# Altium project PocketLab_DMM_EVT0.PrjPcb (part 2 of 2)

## Sheet 40_INPUT_ROUTING.SchDoc
size A; SheetNumber: 5; SheetTotal: 8
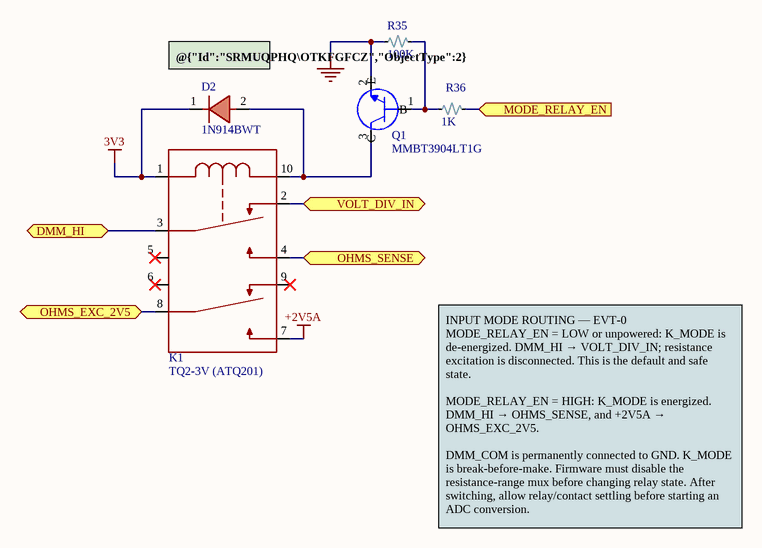
[diagram p2: 40_INPUT_ROUTING.SchDoc]

### Parts
D2  1N914BWT  [1N914BWT]
K1  TQ2-3V (ATQ201)  [TQ2-3V]
Q1  MMBT3904LT1G  [MMBT3904]
R35  100K  [R0805]
R36  1K  [R0805]

### Ports
DMM_HI (bidir, see 00_SYSTEM_TOP[4C], 70_MODULE_INTERFACE[1B]), MODE_RELAY_EN (in, see 00_SYSTEM_TOP[3B], 20_MCU_BLE[1C]), OHMS_EXC_2V5 (bidir, see 00_SYSTEM_TOP[4B], 60_RESISTANCE_FRONTEND[4B]), OHMS_SENSE (bidir, see 00_SYSTEM_TOP[3B], 60_RESISTANCE_FRONTEND[2B]), VOLT_DIV_IN (bidir, see 00_SYSTEM_TOP[3C], 50_VOLTAGE_FRONTEND[2B])

### Nets
3V3: D2.1(cathode) K1.1
+2V5A: K1.7
GND: Q1.2(E) R35.1
NetD2_2: D2.2(anode) K1.10 Q1.3(C)
NetJ4_1: K1.3 ; port DMM_HI
NetK1_2: K1.2 ; port VOLT_DIV_IN
NetK1_4: K1.4 ; port OHMS_SENSE
NetK1_8: K1.8 ; port OHMS_EXC_2V5
NetQ1_1: Q1.1(B) R35.2 R36.1
NetR36_2: R36.2 ; port MODE_RELAY_EN

Not connected (* = marked no-connect by the designer): K1 5* 6* 9*

### Notes on the sheet
- (near D2) @{"Id":"SRMUQPHQ\OTKFGFCZ","ObjectType":2} V/Ω Select
- INPUT MODE ROUTING — EVT-0
  MODE_RELAY_EN = LOW or unpowered: K_MODE is de-energized. DMM_HI → VOLT_DIV_IN; resistance excitation is disconnected. This is the default and safe state.
  MODE_RELAY_EN = HIGH: K_MODE is energized. DMM_HI → OHMS_SENSE, and +2V5A → OHMS_EXC_2V5.
  DMM_COM is permanently connected to GND. K_MODE is break-before-make. Firmware must disable the resistance-range mux before changing relay state. After switching, allow relay/contact settling before starting an ADC conversion.

### Library data of the parts
D2 = 1N914BWT: DIODE STANDARD 75V 200MA SOD523F; Manufacturer: onsemi; Manufacturer Lifecycle Status: ACTIVE; Value: 4pF; Element Configuration: Single; Forward Current: 300mA; Forward Voltage: 720mV; Max Junction Temperature (Tj): 150°C; Max Output current: 150mA; Max Power Dissipation: 200mW; Max Reverse Leakage Current: 5µA; Number of Elements: 1; Recovery Time: 4ns; Reverse Voltage: 100V; Supplier: DigiKey; Supplier Part Number: 1N914BWTCT-ND; Manufacturer Part Number: 1N914BWT; RoHS: Compliant; Category: Rectifier Diodes; Stock: 1541183; Pricing: 1=0.17, 10=0.102, 50=0.0726, 100=0.0629, 500=0.04556 (USD); Average Rectified Current: 200mA; China RoHS: Compliant; Contact Plating: Tin; Country of Origin: Mainland China; Export Control Classification Number (ECCN) Code: EAR99; Height: 700µm; Harmonized Tariff Schedule (HTS) Code: 8541.10.00.70; Introduction Date: 2008-03-18; Lead Free: Lead Free; Lifecycle Status: Production; Max Operating Temperature: 150°C; Max Repetitive Reverse Voltage (Vrrm): 75V; Max Reverse Voltage (DC): 75V; Min Operating Temperature: -55°C; Mounting Technology: Surface Mount; Pins: 2; Number of Terminals: 2; Peak Reverse Current: 5µA; Power Dissipation: 200mW; Radiation Hardening: No; REACH SVHC: Yes; Reverse Recovery Time: 4ns; Reverse Standoff Voltage: 75V; Schedule B: 8541100070, 8541100070|8541100070|8541100070|8541100070|8541100070; Weight: 10mg; ComponentLink1URL: https://datasheet.octopart.com:443/1N914BWT-ON-Semiconductor-datasheet-137236191.pdf?src-supplier=JRH+Electronics; ComponentLink1Description: https://datasheet.octopart.com:443/1N914BWT-ON-Semiconductor-datasheet-137236191.pdf?src-supplier=JRH+Electronics; ComponentLink2URL: https://sigma.octopart.com:443/138897313/technical_drawing/ON-Semiconductor-1N914BWT.pdf?src-supplier=Upverter; ComponentLink2Description: https://sigma.octopart.com:443/138897313/technical_drawing/ON-Semiconductor-1N914BWT.pdf?src-supplier=Upverter; ComponentLink3URL: https://datasheet.octopart.com:443/1N914BWT-ON-Semiconductor-datasheet-8641207.pdf?src-supplier=IHS; ComponentLink3Description: https://datasheet.octopart.com:443/1N914BWT-ON-Semiconductor-datasheet-8641207.pdf?src-supplier=IHS; ComponentLink4URL: https://datasheet.octopart.com:443/1N914BWT-onsemi-datasheet-181265884.pdf?src-supplier=IHS; ComponentLink4Description: https://datasheet.octopart.com:443/1N914BWT-onsemi-datasheet-181265884.pdf?src-supplier=IHS; ComponentLink5URL: https://datasheet.octopart.com:443/1N914BWT-ON-Semiconductor-datasheet-85393215.pdf?src-supplier=onsemi; ComponentLink5Description: https://datasheet.octopart.com:443/1N914BWT-ON-Semiconductor-datasheet-85393215.pdf?src-supplier=onsemi; ComponentLink6URL: https://datasheet.octopart.com:443/1N914BWT-ON-Semiconductor-datasheet-86684494.pdf?src-supplier=onsemi; ComponentLink6Description: https://datasheet.octopart.com:443/1N914BWT-ON-Semiconductor-datasheet-86684494.pdf?src-supplier=onsemi; ComponentLink7URL: https://datasheet.octopart.com:443/1N914BWT-ON-Semiconductor-datasheet-86681974.pdf?src-supplier=element14+APAC; ComponentLink7Description: https://datasheet.octopart.com:443/1N914BWT-ON-Semiconductor-datasheet-86681974.pdf?src-supplier=element14+APAC; ComponentLink8URL: https://datasheet.octopart.com:443/1N914BWT-Fairchild-datasheet-597795.pdf?src-supplier=Future+Electronics; ComponentLink8Description: https://datasheet.octopart.com:443/1N914BWT-Fairchild-datasheet-597795.pdf?src-supplier=Future+Electronics; ComponentLink9URL: https://sigma.octopart.com:443/17343427/technical_drawing/Fairchild-Semiconductor-1N914BWT.pdf?src-supplier=Fairchild+Semiconductor; ComponentLink9Description: https://sigma.octopart.com:443/17343427/technical_drawing/Fairchild-Semiconductor-1N914BWT.pdf?src-supplier=Fairchild+Semiconductor; ComponentLink10URL: https://datasheet.octopart.com:443/1N914BWT-Fairchild-Semiconductor-datasheet-67878665.pdf?src-supplier=Farnell; ComponentLink10Description: https://datasheet.octopart.com:443/1N914BWT-Fairchild-Semiconductor-datasheet-67878665.pdf?src-supplier=Farnell; ComponentLink11URL: https://datasheet.octopart.com:443/1N914BWT-Fairchild-Semiconductor-datasheet-68649996.pdf?src-supplier=Farnell; ComponentLink11Description: https://datasheet.octopart.com:443/1N914BWT-Fairchild-Semiconductor-datasheet-68649996.pdf?src-supplier=Farnell; ComponentLink12URL: https://datasheet.octopart.com:443/1N914BWT-Fairchild-Semiconductor-datasheet-78857206.pdf?src-supplier=Farnell; ComponentLink12Description: https://datasheet.octopart.com:443/1N914BWT-Fairchild-Semiconductor-datasheet-78857206.pdf?src-supplier=Farnell; ComponentLink13URL: https://datasheet.octopart.com:443/1N914BWT-Fairchild-Semiconductor-datasheet-67909706.pdf?src-supplier=Newark; ComponentLink13Description: https://datasheet.octopart.com:443/1N914BWT-Fairchild-Semiconductor-datasheet-67909706.pdf?src-supplier=Newark; ComponentLink14URL: https://datasheet.octopart.com:443/1N914BWT-Fairchild-Semiconductor-datasheet-68364971.pdf?src-supplier=Newark; ComponentLink14Description: https://datasheet.octopart.com:443/1N914BWT-Fairchild-Semiconductor-datasheet-68364971.pdf?src-supplier=Newark; ComponentLink15URL: https://datasheet.octopart.com:443/1N914BWT-Fairchild-Semiconductor-datasheet-71421042.pdf?src-supplier=Newark; ComponentLink15Description: https://datasheet.octopart.com:443/1N914BWT-Fairchild-Semiconductor-datasheet-71421042.pdf?src-supplier=Newark; ComponentLink16URL: http://sigma.octopart.com:80/150599636/rohs_statement/ON-Semiconductor-1N914BWT.pdf?src-supplier=Compliance+Statements; ComponentLink16Description: http://sigma.octopart.com:80/150599636/rohs_statement/ON-Semiconductor-1N914BWT.pdf?src-supplier=Compliance+Statements; ComponentLink17URL: http://sigma.octopart.com:80/17343722/reach_statement/Fairchild-Semiconductor-1N914BWT.pdf?src-supplier=Compliance+Statements; ComponentLink17Description: http://sigma.octopart.com:80/17343722/reach_statement/Fairchild-Semiconductor-1N914BWT.pdf?src-supplier=Compliance+Statements; ComponentLink18URL: http://sigma.octopart.com:80/17343723/materials_sheet/Fairchild-Semiconductor-1N914BWT.pdf?src-supplier=Compliance+Statements; ComponentLink18Description: http://sigma.octopart.com:80/17343723/materials_sheet/Fairchild-Semiconductor-1N914BWT.pdf?src-supplier=Compliance+Statements; ComponentLink19URL: http://sigma.octopart.com:80/33033631/reach_statement/Fairchild-Semiconductor-1N914BWT.pdf?src-supplier=Compliance+Statements; ComponentLink19Description: http://sigma.octopart.com:80/33033631/reach_statement/Fairchild-Semiconductor-1N914BWT.pdf?src-supplier=Compliance+Statements; ComponentLink20URL: http://sigma.octopart.com:80/33033633/materials_sheet/Fairchild-Semiconductor-1N914BWT.pdf?src-supplier=Compliance+Statements; ComponentLink20Description: http://sigma.octopart.com:80/33033633/materials_sheet/Fairchild-Semiconductor-1N914BWT.pdf?src-supplier=Compliance+Statements; ComponentLink21URL: http://sigma.octopart.com:80/reach_statement/ON-Semiconductor-company-79.pdf?src-supplier=Compliance+Statements; ComponentLink21Description: http://sigma.octopart.com:80/reach_statement/ON-Semiconductor-company-79.pdf?src-supplier=Compliance+Statements; ComponentLink22URL: http://sigma.octopart.com:80/rohs_statement/Fairchild-Semiconductor-company-11.pdf?src-supplier=Compliance+Statements; ComponentLink22Description: http://sigma.octopart.com:80/rohs_statement/Fairchild-Semiconductor-company-11.pdf?src-supplier=Compliance+Statements; ComponentLink23URL: http://sigma.octopart.com:80/rohs_statement/Fairchild-Semiconductor-company-10.pdf?src-supplier=Compliance+Statements; ComponentLink23Description: http://sigma.octopart.com:80/rohs_statement/Fairchild-Semiconductor-company-10.pdf?src-supplier=Compliance+Statements; ComponentLink24URL: http://sigma.octopart.com:80/reach_statement/Fairchild-Semiconductor-company-9.pdf?src-supplier=Compliance+Statements; ComponentLink24Description: http://sigma.octopart.com:80/reach_statement/Fairchild-Semiconductor-company-9.pdf?src-supplier=Compliance+Statements; ComponentLink25URL: https://octopart.com:443/opatz8j6/c1?t=AH9zcMxkeAdW6q2Eq6b7IE3o8p7oJyfCCWP2LD7p9dkg8_1XgT_uIYUIfv7lhcHO3Lm2dWJ0vyWcCXTmI-m6i_e3bz1ygKnSbTknupXSFzBNj_HpxZskJCgN2zBylGov1HFklhlqrpHlO6K5AZ62MDKnKfmeey-sKx5zLLXPz3vdpqjCapaf97_w5ymRJ4vykqn37E9iqiVHqZfTnoawsGL7kQ2_tC5XJG82m9dj8CjUa7IyLd46aJZw47PNoUwIy-tktB34mxPYkgoIYMPq_y-2_Zl7oOQxNhckIE8NgxTfVSFSWYFJhemMnrsZ4FmlJAaE9JBv7LsFpjF61P3RKffqM8U7tIBEs0IC&src-supplier=Compliance+Statements; ComponentLink25Description: https://octopart.com:443/opatz8j6/c1?t=AH9zcMxkeAdW6q2Eq6b7IE3o8p7oJyfCCWP2LD7p9dkg8_1XgT_uIYUIfv7lhcHO3Lm2dWJ0vyWcCXTmI-m6i_e3bz1ygKnSbTknupXSFzBNj_HpxZskJCgN2zBylGov1HFklhlqrpHlO6K5AZ62MDKnKfmeey-sKx5zLLXPz3vdpqjCapaf97_w5ymRJ4vykqn37E9iqiVHqZfTnoawsGL7kQ2_tC5XJG82m9dj8CjUa7IyLd46aJZw47PNoUwIy-tktB34mxPYkgoIYMPq_y-2_Zl7oOQxNhckIE8NgxTfVSFSWYFJhemMnrsZ4FmlJAaE9JBv7LsFpjF61P3RKffqM8U7tIBEs0IC&src-supplier=Compliance+Statements; ComponentLink26URL: https://octopart.com:443/opatz8j6/c1?t=xkFbza4jrI2CRbegTQyc3OoFkt0wJLseTZvNZoS9ZK7og4IYeJkRm8Wtlicq30gKrCmXKYAvwhfUWUd8QrgiWtGr-1lPch9YM6_eRKvxcMBeJPMVF6fuXrX8qVzrjdJE_ba4nBK8Av8ejJiUOIqoCK4JwxbrI670KPmrS7lZhK3d4M9ClcgV1EdcA89oUfKfxSXdDQ7ptMPVQyO9dYqcVLlwZjgXP6pJFSDaJyXdYctBiNO3pJoYg6YNiGqR74o654sFLuxF_heBqsxkg6UEULjNDBDBmm8bGtxjuaEt4DFGZZVVzAgQnbURpSvQrJSnNWgco6nydRWV0EfJMGefeNg22mY4HSjyeBXs9g&src-supplier=Compliance+Statements; ComponentLink26Description: https://octopart.com:443/opatz8j6/c1?t=xkFbza4jrI2CRbegTQyc3OoFkt0wJLseTZvNZoS9ZK7og4IYeJkRm8Wtlicq30gKrCmXKYAvwhfUWUd8QrgiWtGr-1lPch9YM6_eRKvxcMBeJPMVF6fuXrX8qVzrjdJE_ba4nBK8Av8ejJiUOIqoCK4JwxbrI670KPmrS7lZhK3d4M9ClcgV1EdcA89oUfKfxSXdDQ7ptMPVQyO9dYqcVLlwZjgXP6pJFSDaJyXdYctBiNO3pJoYg6YNiGqR74o654sFLuxF_heBqsxkg6UEULjNDBDBmm8bGtxjuaEt4DFGZZVVzAgQnbURpSvQrJSnNWgco6nydRWV0EfJMGefeNg22mY4HSjyeBXs9g&src-supplier=Compliance+Statements
K1 = TQ2-3V: Electromechanical Relay Double Pole Double Throw 1A 3 Volt 64.3Ohm Through Hole; Manufacturer: Panasonic; Manufacturer Lifecycle Status: ACTIVE; Coil Current: 47mA; Coil Power: 140mW; Coil Resistance: 64.3Ω; Coil Type: Non-Latching; Coil Voltage (DC): 2.25V; Contact Resistance: 50Ω; Contact Voltage Rating (AC): 125V; Electrical Life: 200kcycles; Insertion Loss (dB): 0.6dB; Max Voltage Rating (DC): 110V; Number of Contacts: 2; Operate Time: 3ms; Power Dissipation: 140W; Ratings: CSA; Relay Type: Telecom; Throw Configuration: DPDT; Supplier: DigiKey; Supplier Part Number: 255-1225-5-ND; Manufacturer Part Number: TQ2-3V; RoHS: Compliant; Category: Signal Relays; Stock: 2058; Pricing: 1=2.36, 10=2.103, 25=2.0084, 50=1.9398, 100=1.8734, 250=1.78892, 500=1.72756, 1000=1.66825, 5000=1.53812 (USD); Case/Package: DIP; Contact Current Rating: 1A; Contact Material: Gold, Silver; Contact Plating: Gold, Silver; Current Rating: 1A; Depth: 9mm; Height: 5mm; Lead Free: Lead Free; Length: 14mm; Lifecycle Status: Production; Max Current Rating: 1A; Max Operating Temperature: 70°C; Max Voltage Rating (AC): 125V; Min Operating Temperature: -40°C; Mounting Technology: Through Hole; Pins: 8; Packaging: Bulk; Power Consumption: 140mW; Radiation Hardening: No; REACH SVHC: Yes; Release Time: 3ms; Response Time: 3ms; Switching Current: 1A; Termination: Solder; Type: Electromechanical; Voltage Rating (AC): 125V; Voltage Rating (DC): 110V; Weight: 1.5g; Width: 9mm; ComponentLink1URL: https://datasheet.octopart.com:443/TQ2-3V-Panasonic-datasheet-8361856.pdf?src-supplier=Panasonic; ComponentLink1Description: https://datasheet.octopart.com:443/TQ2-3V-Panasonic-datasheet-8361856.pdf?src-supplier=Panasonic; ComponentLink2URL: https://datasheet.octopart.com:443/TQ2-3V-Panasonic-datasheet-11522959.pdf?src-supplier=Panasonic; ComponentLink2Description: https://datasheet.octopart.com:443/TQ2-3V-Panasonic-datasheet-11522959.pdf?src-supplier=Panasonic; ComponentLink3URL: https://datasheet.octopart.com:443/TQ2-3V-Panasonic-datasheet-34148902.pdf?src-supplier=IHS; ComponentLink3Description: https://datasheet.octopart.com:443/TQ2-3V-Panasonic-datasheet-34148902.pdf?src-supplier=IHS; ComponentLink4URL: https://datasheet.octopart.com:443/TQ2-3V-Panasonic-datasheet-109883.pdf?src-supplier=element14; ComponentLink4Description: https://datasheet.octopart.com:443/TQ2-3V-Panasonic-datasheet-109883.pdf?src-supplier=element14; ComponentLink5URL: https://datasheet.octopart.com:443/TQ2-3V-Panasonic-datasheet-16066.pdf?src-supplier=element14; ComponentLink5Description: https://datasheet.octopart.com:443/TQ2-3V-Panasonic-datasheet-16066.pdf?src-supplier=element14; ComponentLink6URL: https://datasheet.octopart.com:443/TQ2-3V-Panasonic-datasheet-12570800.pdf?src-supplier=Farnell; ComponentLink6Description: https://datasheet.octopart.com:443/TQ2-3V-Panasonic-datasheet-12570800.pdf?src-supplier=Farnell; ComponentLink7URL: https://datasheet.octopart.com:443/TQ2-3V-Panasonic-datasheet-136735749.pdf?src-supplier=Electro+Sonic; ComponentLink7Description: https://datasheet.octopart.com:443/TQ2-3V-Panasonic-datasheet-136735749.pdf?src-supplier=Electro+Sonic; ComponentLink8URL: https://datasheet.octopart.com:443/TQ2-3V-Panasonic-datasheet-27895613.pdf?src-supplier=Electro+Sonic; ComponentLink8Description: https://datasheet.octopart.com:443/TQ2-3V-Panasonic-datasheet-27895613.pdf?src-supplier=Electro+Sonic; ComponentLink9URL: https://datasheet.octopart.com:443/TQ2-3V-Panasonic-EW-datasheet-23711783.pdf?src-supplier=Electro+Sonic; ComponentLink9Description: https://datasheet.octopart.com:443/TQ2-3V-Panasonic-EW-datasheet-23711783.pdf?src-supplier=Electro+Sonic; ComponentLink10URL: https://datasheet.octopart.com:443/TQ2-3V-Panasonic-datasheet-164871806.pdf?src-supplier=Burklin+Elektronik; ComponentLink10Description: https://datasheet.octopart.com:443/TQ2-3V-Panasonic-datasheet-164871806.pdf?src-supplier=Burklin+Elektronik; ComponentLink11URL: https://datasheet.octopart.com:443/TQ2-3V-Panasonic-datasheet-152536022.pdf?src-supplier=Master+Electronics; ComponentLink11Description: https://datasheet.octopart.com:443/TQ2-3V-Panasonic-datasheet-152536022.pdf?src-supplier=Master+Electronics; ComponentLink12URL: https://datasheet.octopart.com:443/TQ2-3V-Panasonic-datasheet-138897391.pdf?src-supplier=Sager+Electronics; ComponentLink12Description: https://datasheet.octopart.com:443/TQ2-3V-Panasonic-datasheet-138897391.pdf?src-supplier=Sager+Electronics; ComponentLink13URL: https://datasheet.octopart.com:443/TQ2-3V-Panasonic-datasheet-13694242.pdf?src-supplier=_legacy+Avnet; ComponentLink13Description: https://datasheet.octopart.com:443/TQ2-3V-Panasonic-datasheet-13694242.pdf?src-supplier=_legacy+Avnet; ComponentLink14URL: https://datasheet.octopart.com:443/TQ2-3V-Panasonic-datasheet-7279417.pdf?src-supplier=Jameco+(USA); ComponentLink14Description: https://datasheet.octopart.com:443/TQ2-3V-Panasonic-datasheet-7279417.pdf?src-supplier=Jameco+(USA); Supplier 1: Future Electronics; Supplier Part Number 1: TQ2-3V
Q1 = MMBT3904LT1G: TRANS NPN 40V 0.2A SOT23-3; Manufacturer: onsemi; Manufacturer Lifecycle Status: ACTIVE; Collector Base Voltage (VCBO): 60V; Collector Emitter Saturation Voltage: 200mV; Current Rating: 200mA; Element Configuration: Single; Emitter Base Voltage (VEBO): 6V; Frequency: 300MHz; hFE Min: 30; Max Junction Temperature (Tj): 150°C; Max Power Dissipation: 300mW; Number of Elements: 1; Power Dissipation: 225mW; Type: General Purpose; Supplier: DigiKey; Supplier Part Number: MMBT3904LT1GOSDKR-ND; Manufacturer Part Number: MMBT3904LT1G; RoHS: Compliant; Category: BJTs; Stock: 189758; Pricing: 1=0.14, 10=0.086, 100=0.0527, 500=0.03806, 1000=0.03329 (USD); Case/Package: SOT-23; China RoHS: Compliant; Collector Emitter Breakdown Voltage: 40V; Collector Emitter Voltage (VCEO): 40V; Contact Plating: Tin; Gain Bandwidth Product: 300MHz; Height: 1.11mm; Lead Free: Lead Free; Length: 2.9mm; Lifecycle Status: Production; Max Breakdown Voltage: 40V; Max Collector Current: 200mA; Clock Frequency: 300MHz; Max Operating Temperature: 150°C; Min Operating Temperature: -55°C; Pins: 3; Number of Terminals: 3; Packaging: Tape and Reel; Polarity: NPN; Radiation Hardening: No; REACH SVHC: Yes; Schedule B: 8541210080; Transition Frequency: 300MHz; Voltage Rating (DC): 40V; Width: 1.3mm; ComponentLink1URL: https://datasheet.octopart.com:443/MMBT3904LT1G-ON-Semiconductor-datasheet-11971584.pdf?src-supplier=Upverter; ComponentLink1Description: https://datasheet.octopart.com:443/MMBT3904LT1G-ON-Semiconductor-datasheet-11971584.pdf?src-supplier=Upverter; ComponentLink2URL: https://datasheet.octopart.com:443/MMBT3904LT1G-ON-Semiconductor-datasheet-618661.pdf?src-supplier=Upverter; ComponentLink2Description: https://datasheet.octopart.com:443/MMBT3904LT1G-ON-Semiconductor-datasheet-618661.pdf?src-supplier=Upverter; ComponentLink3URL: https://datasheet.octopart.com:443/MMBT3904LT1G-ON-Semiconductor-datasheet-8327178.pdf?src-supplier=Upverter; ComponentLink3Description: https://datasheet.octopart.com:443/MMBT3904LT1G-ON-Semiconductor-datasheet-8327178.pdf?src-supplier=Upverter; ComponentLink4URL: https://sigma.octopart.com:443/138897241/technical_drawing/ON-Semiconductor-MMBT3904LT1G.pdf?src-supplier=Upverter; ComponentLink4Description: https://sigma.octopart.com:443/138897241/technical_drawing/ON-Semiconductor-MMBT3904LT1G.pdf?src-supplier=Upverter; ComponentLink5URL: https://datasheet.octopart.com:443/MMBT3904LT1G-ON-Semiconductor-datasheet-94100684.pdf?src-supplier=Newark; ComponentLink5Description: https://datasheet.octopart.com:443/MMBT3904LT1G-ON-Semiconductor-datasheet-94100684.pdf?src-supplier=Newark; ComponentLink6URL: https://datasheet.octopart.com:443/MMBT3904LT1G-onsemi-datasheet-175423507.pdf?src-supplier=IHS; ComponentLink6Description: https://datasheet.octopart.com:443/MMBT3904LT1G-onsemi-datasheet-175423507.pdf?src-supplier=IHS; ComponentLink7URL: https://datasheet.octopart.com:443/MMBT3904LT1G-ON-Semiconductor-datasheet-15850735.pdf?src-supplier=element14+APAC; ComponentLink7Description: https://datasheet.octopart.com:443/MMBT3904LT1G-ON-Semiconductor-datasheet-15850735.pdf?src-supplier=element14+APAC; ComponentLink8URL: https://datasheet.octopart.com:443/MMBT3904LT1G-onsemi-datasheet-157205106.pdf?src-supplier=TME; ComponentLink8Description: https://datasheet.octopart.com:443/MMBT3904LT1G-onsemi-datasheet-157205106.pdf?src-supplier=TME; ComponentLink9URL: https://datasheet.octopart.com:443/MMBT3904LT1G-ON-Semiconductor-datasheet-42916338.pdf?src-supplier=Seeed+Studio; ComponentLink9Description: https://datasheet.octopart.com:443/MMBT3904LT1G-ON-Semiconductor-datasheet-42916338.pdf?src-supplier=Seeed+Studio; ComponentLink10URL: https://datasheet.octopart.com:443/MMBT3904LT1G-ON-Semiconductor-datasheet-14065146.pdf?src-supplier=iiiC; ComponentLink10Description: https://datasheet.octopart.com:443/MMBT3904LT1G-ON-Semiconductor-datasheet-14065146.pdf?src-supplier=iiiC; ComponentLink11URL: https://datasheet.octopart.com:443/MMBT3904LT1G-onsemi-datasheet-11078203.pdf?src-supplier=Master+Electronics; ComponentLink11Description: https://datasheet.octopart.com:443/MMBT3904LT1G-onsemi-datasheet-11078203.pdf?src-supplier=Master+Electronics; ComponentLink12URL: https://datasheet.octopart.com:443/MMBT3904LT1G-ON-Semiconductor-datasheet-9992889.pdf?src-supplier=RS+(Formerly+Allied+Electronics); ComponentLink12Description: https://datasheet.octopart.com:443/MMBT3904LT1G-ON-Semiconductor-datasheet-9992889.pdf?src-supplier=RS+(Formerly+Allied+Electronics); ComponentLink13URL: http://sigma.octopart.com:80/150618431/rohs_statement/ON-Semiconductor-MMBT3904LT1G.pdf?src-supplier=Compliance+Statements; ComponentLink13Description: http://sigma.octopart.com:80/150618431/rohs_statement/ON-Semiconductor-MMBT3904LT1G.pdf?src-supplier=Compliance+Statements; ComponentLink14URL: http://sigma.octopart.com:80/reach_statement/ON-Semiconductor-company-79.pdf?src-supplier=Compliance+Statements; ComponentLink14Description: http://sigma.octopart.com:80/reach_statement/ON-Semiconductor-company-79.pdf?src-supplier=Compliance+Statements; ComponentLink15URL: http://sigma.octopart.com:80/rohs_statement/Fairchild-Semiconductor-company-11.pdf?src-supplier=Compliance+Statements; ComponentLink15Description: http://sigma.octopart.com:80/rohs_statement/Fairchild-Semiconductor-company-11.pdf?src-supplier=Compliance+Statements; ComponentLink16URL: http://sigma.octopart.com:80/rohs_statement/Fairchild-Semiconductor-company-10.pdf?src-supplier=Compliance+Statements; ComponentLink16Description: http://sigma.octopart.com:80/rohs_statement/Fairchild-Semiconductor-company-10.pdf?src-supplier=Compliance+Statements; ComponentLink17URL: http://sigma.octopart.com:80/reach_statement/Fairchild-Semiconductor-company-9.pdf?src-supplier=Compliance+Statements; ComponentLink17Description: http://sigma.octopart.com:80/reach_statement/Fairchild-Semiconductor-company-9.pdf?src-supplier=Compliance+Statements; ComponentLink18URL: https://octopart.com:443/opatz8j6/c1?t=6Xn7ZrF6hysOUC84qlrSqY4wiQdrN-mPXKQ_8Rla8IkVly0DBC3XMOxgBnPoFxbPxSduxt1CU9xvbCNH0dZZ2fSPxrCiu0NHjXK1AEqfl5xODuP5YJP7pfSgZ8QNFl02tAnTqW6w1aVJmMTvNdbX5LfPzPLhtU1PYqNVsEPH2I4uNn2UF3IV2P2UT1zVRcnQIPoIWXKohBgaCPKWifMJG2N61Au2Wz4170xn6Vu5FG_CLPs0I4wu6gksT39gSmG6GKW27rzSZjefFxUNhsDMvXXdZPXoa_giO80NkyKEb8_6ha9AliWeLbEvMGgfnng9nYF8sw6XCX6uqkfeLxUIFVSSx4aXaZZhz9egcw&src-supplier=Compliance+Statements; ComponentLink18Description: https://octopart.com:443/opatz8j6/c1?t=6Xn7ZrF6hysOUC84qlrSqY4wiQdrN-mPXKQ_8Rla8IkVly0DBC3XMOxgBnPoFxbPxSduxt1CU9xvbCNH0dZZ2fSPxrCiu0NHjXK1AEqfl5xODuP5YJP7pfSgZ8QNFl02tAnTqW6w1aVJmMTvNdbX5LfPzPLhtU1PYqNVsEPH2I4uNn2UF3IV2P2UT1zVRcnQIPoIWXKohBgaCPKWifMJG2N61Au2Wz4170xn6Vu5FG_CLPs0I4wu6gksT39gSmG6GKW27rzSZjefFxUNhsDMvXXdZPXoa_giO80NkyKEb8_6ha9AliWeLbEvMGgfnng9nYF8sw6XCX6uqkfeLxUIFVSSx4aXaZZhz9egcw&src-supplier=Compliance+Statements; ComponentLink19URL: https://octopart.com:443/opatz8j6/c1?t=8IRzLcMOYTb9JijI-po6TFZCAUzXib-H1R20XCLpzmhIGre0bWRXe4ZO8lRdDfF3CLOGncXrdohN3KmiOTqxwjTHC1r89hWIZDbBVEUVc9Q9O159qKwDTUXpIzAsHJigIaeBGLyIo10FCT0IJpWkJe3Af8Ts36u8FHUZlIMCnry_JzPNglOFJd8Q37gYK_hPK5FL94xWLlsZYNj58V_g4S0R_SZTueiY5oHGNdfq_Zs3fbV3kHE__W-q6emv4yhSM8EHIIJwaXdr2iL-5-sB4yTOqwO_ItA84y4jC2VE_619edN7Ju53SNxRGHixzhXtKIq-sYkPqUptt85PTjBtSIydYnRzf0D6rRR5&src-supplier=Compliance+Statements; ComponentLink19Description: https://octopart.com:443/opatz8j6/c1?t=8IRzLcMOYTb9JijI-po6TFZCAUzXib-H1R20XCLpzmhIGre0bWRXe4ZO8lRdDfF3CLOGncXrdohN3KmiOTqxwjTHC1r89hWIZDbBVEUVc9Q9O159qKwDTUXpIzAsHJigIaeBGLyIo10FCT0IJpWkJe3Af8Ts36u8FHUZlIMCnry_JzPNglOFJd8Q37gYK_hPK5FL94xWLlsZYNj58V_g4S0R_SZTueiY5oHGNdfq_Zs3fbV3kHE__W-q6emv4yhSM8EHIIJwaXdr2iL-5-sB4yTOqwO_ItA84y4jC2VE_619edN7Ju53SNxRGHixzhXtKIq-sYkPqUptt85PTjBtSIydYnRzf0D6rRR5&src-supplier=Compliance+Statements
R35 R36 = R_0805: RES 1/8W 0805; Manufacturer: Stackpole Electronics; Manufacturer Part Number: RNCF0805TKY10K0; Manufacturer Package Identifier: 0805 (2012 metric); Max Power Dissipation: 125mW; Value: 10kΩ; Temperature Coefficient: 5ppm/°C; Tolerance: 0.01%; Working Voltage: 150V; Supplier: DigiKey; Supplier Part Number: RNCF0805TKY10K0CT-ND; RoHS: Compliant; Category: Chip SMD Resistors; Stock: 4649; Pricing: 1=1.61, 10=1.334, 50=1.1716, 100=1.1105, 500=0.99044, 1000=0.94751, 2000=0.90945, 3000=0.8893, 5000=0.86599, 7000=0.85183, 10000=0.8378 (USD); Case/Package: 0805; Case Code (Imperial): 0805; Case Code (Metric): 2012; Composition: Thin Film; Country of Origin: Taiwan; Export Control Classification Number (ECCN) Code: EAR99; Features: Moisture Resistant; Height: 550µm; Harmonized Tariff Schedule (HTS) Code: 8533.21.00.30; Introduction Date: 2011-06-03; Lead Free: Lead Free; Length: 2mm; Lifecycle Status: Production; Max Operating Temperature: 155°C; Min Operating Temperature: -55°C; Mounting Technology: Surface Mount; Number of Terminals: 2; Number of Terminations: 2; Packaging: Tape & Reel (TR); Power Rating: 125mW; Ratings: AEC-Q200; REACH SVHC: Yes; Schedule B: 8533210045, 8533210045|8533210045|8533210045|8533210045|8533210045; Width: 1.25mm; ComponentLink1URL: https://datasheet.octopart.com:443/RNCF0805TKY10K0-Stackpole-Electronics-datasheet-182148124.pdf?src-supplier=IHS; ComponentLink1Description: https://datasheet.octopart.com:443/RNCF0805TKY10K0-Stackpole-Electronics-datasheet-182148124.pdf?src-supplier=IHS; ComponentLink2URL: https://datasheet.octopart.com:443/RNCF0805TKY10K0-Stackpole-Electronics-datasheet-12511394.pdf?src-supplier=Factory+Futures; ComponentLink2Description: https://datasheet.octopart.com:443/RNCF0805TKY10K0-Stackpole-Electronics-datasheet-12511394.pdf?src-supplier=Factory+Futures; ComponentLink3URL: https://datasheet.octopart.com:443/RNCF0805TKY10K0-Stackpole-Electronics-datasheet-141158876.pdf?src-supplier=Stackpole+Electronics; ComponentLink3Description: https://datasheet.octopart.com:443/RNCF0805TKY10K0-Stackpole-Electronics-datasheet-141158876.pdf?src-supplier=Stackpole+Electronics; ComponentLink4URL: https://datasheet.octopart.com:443/RNCF0805TKY10K0-Stackpole-Electronics-datasheet-28504821.pdf?src-supplier=Master+Electronics; ComponentLink4Description: https://datasheet.octopart.com:443/RNCF0805TKY10K0-Stackpole-Electronics-datasheet-28504821.pdf?src-supplier=Master+Electronics; ComponentLink5URL: https://datasheet.octopart.com/RNCF0805TKY10K0-Stackpole-Electronics-datasheet-11755897.pdf; ComponentLink5Description: https://datasheet.octopart.com/RNCF0805TKY10K0-Stackpole-Electronics-datasheet-11755897.pdf; ComponentLink6URL: http://sigma.octopart.com:80/15941409/materials_sheet/Stackpole-Electronics-RNCF0805TKY10K0.pdf?src-supplier=Compliance+Statements; ComponentLink6Description: http://sigma.octopart.com:80/15941409/materials_sheet/Stackpole-Electronics-RNCF0805TKY10K0.pdf?src-supplier=Compliance+Statements; ComponentLink7URL: http://sigma.octopart.com:80/141158212/rohs_statement/Stackpole-Electronics-RNCF0805TKY10K0.pdf?src-supplier=Compliance+Statements; ComponentLink7Description: http://sigma.octopart.com:80/141158212/rohs_statement/Stackpole-Electronics-RNCF0805TKY10K0.pdf?src-supplier=Compliance+Statements; ComponentLink8URL: http://sigma.octopart.com:80/141158211/reach_statement/Stackpole-Electronics-RNCF0805TKY10K0.pdf?src-supplier=Compliance+Statements; ComponentLink8Description: http://sigma.octopart.com:80/141158211/reach_statement/Stackpole-Electronics-RNCF0805TKY10K0.pdf?src-supplier=Compliance+Statements

## Sheet 50_VOLTAGE_FRONTEND.SchDoc
size A; SheetNumber: 7; SheetTotal: 7
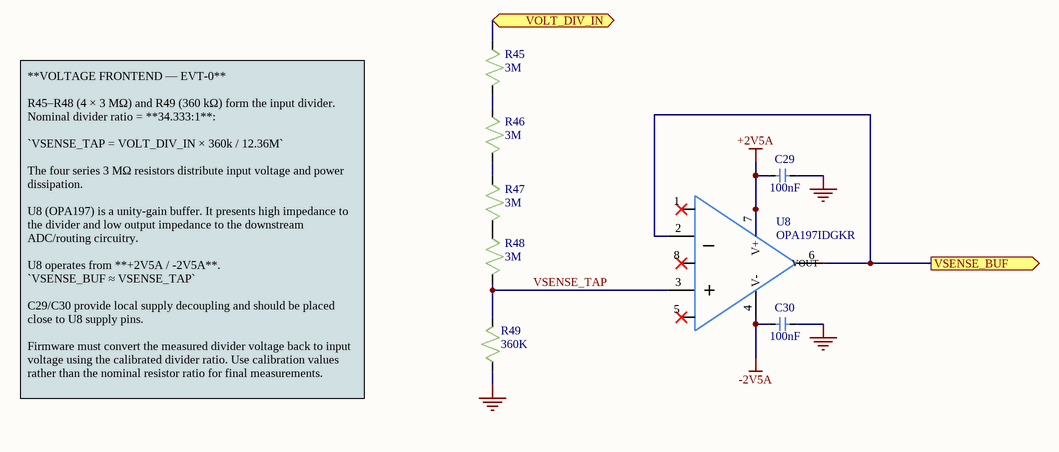
[diagram p3: 50_VOLTAGE_FRONTEND.SchDoc]

### Parts
C29  100nF  [C0805]
C30  100nF  [C0805]
R45  3M  [R1206]
R46  3M  [R1206]
R47  3M  [R1206]
R48  3M  [R1206]
R49  360K  [R1206]
U8  OPA197IDGKR  [OPA197IDGKR]

### Ports
VOLT_DIV_IN (bidir, see 00_SYSTEM_TOP[3C], 40_INPUT_ROUTING[2B]), VSENSE_BUF (out, see 00_SYSTEM_TOP[3C], 30_ADC[2C])

### Nets
+2V5A: C29.1 U8.7(V+)
-2V5A: C30.1 U8.4(V-)
GND: C29.2 C30.2 R49.1
VSENSE_BUF: U8.2(_) U8.6(VOUT) ; port VSENSE_BUF
VSENSE_TAP: R48.2 R49.2 U8.3(+)
NetK1_2: R45.1 ; port VOLT_DIV_IN
NetR45_2: R45.2 R46.1
NetR46_2: R46.2 R47.1
NetR47_2: R47.2 R48.1

Not connected (* = marked no-connect by the designer): U8 1* 5* 8*

### Notes on the sheet
- **VOLTAGE FRONTEND — EVT-0**
  R45–R48 (4 × 3 MΩ) and R49 (360 kΩ) form the input divider.
  Nominal divider ratio = **34.333:1**:
  `VSENSE_TAP = VOLT_DIV_IN × 360k / 12.36M`
  The four series 3 MΩ resistors distribute input voltage and power dissipation.
  U8 (OPA197) is a unity-gain buffer. It presents high impedance to the divider and low output impedance to the downstream ADC/routing circuitry.
  U8 operates from **+2V5A / -2V5A**.
  `VSENSE_BUF ≈ VSENSE_TAP`
  C29/C30 provide local supply decoupling and should be placed close to U8 supply pins.
  Firmware must convert the measured divider voltage back to input voltage using the calibrated divider ratio. Use calibration values rather than the nominal resistor ratio for final measurements.

### Library data of the parts
C29 C30 = C_0805
R45-R48 = RGV3216P-3004-B-T1: RES 3M OHM 0.1% 1/4W 1206; Manufacturer: Susumu; Power Rating: 250mW; Value: 3MΩ; Temperature Coefficient: 25ppm/°C; Working Voltage: 700V; Supplier: DigiKey; Supplier Part Number: 408-RGV3216P-3004-B-T1CT-ND; Manufacturer Part Number: RGV3216P-3004-B-T1; RoHS: Compliant; Category: Chip SMD Resistors; Stock: 5108; Pricing: 1=0.4, 10=0.332, 50=0.291, 100=0.2751, 500=0.243 (USD); Case/Package: 1206; Composition: Thin Film; Height: 400µm; Length: 3.2mm; Lifecycle Status: Production; Max Operating Temperature: 155°C; Min Operating Temperature: -55°C; Mounting Technology: Surface Mount; Number of Terminals: 2; Ratings: AEC-Q200; REACH SVHC: Yes; Tolerance: 0.1%; Width: 1.6mm; ComponentLink1URL: https://datasheet.octopart.com:443/RGV3216P-3004-B-T1-Susumu-datasheet-182148317.pdf?src-supplier=IHS; ComponentLink1Description: https://datasheet.octopart.com:443/RGV3216P-3004-B-T1-Susumu-datasheet-182148317.pdf?src-supplier=IHS
R49 = RGV3216P-3603-B-T1: RES 360K OHM 0.1% 1/4W 1206; Manufacturer: Susumu; Power Rating: 250mW; Value: 360kΩ; Temperature Coefficient: 25ppm/°C; Working Voltage: 700V; Supplier: DigiKey; Supplier Part Number: 408-RGV3216P-3603-B-T1CT-ND; Manufacturer Part Number: RGV3216P-3603-B-T1; RoHS: Compliant; Category: Chip SMD Resistors; Stock: 572; Pricing: 1=0.38, 10=0.313, 50=0.2746, 100=0.2595, 500=0.22926 (USD); Case/Package: 1206; Composition: Thin Film; Export Control Classification Number (ECCN) Code: EAR99; Height: 400µm; Harmonized Tariff Schedule (HTS) Code: 8533.21.00.30; Introduction Date: 2020-06-08; Length: 3.2mm; Lifecycle Status: Production; Max Operating Temperature: 155°C; Min Operating Temperature: -55°C; Mounting Technology: Surface Mount; Number of Terminals: 2; Ratings: AEC-Q200; REACH SVHC: Yes; Tolerance: 0.1%; Width: 1.6mm; ComponentLink1URL: https://datasheet.octopart.com:443/RGV3216P-3603-B-T1-Susumu-datasheet-182148317.pdf?src-supplier=IHS; ComponentLink1Description: https://datasheet.octopart.com:443/RGV3216P-3603-B-T1-Susumu-datasheet-182148317.pdf?src-supplier=IHS
U8 = OPA197IDGKR: Precision rail-to-rail operational amplifier; Manufacturer: Texas Instruments; Manufacturer Lifecycle Status: ACTIVE; Bandwidth: 10MHz; Input Bias Current: 5pA; Input Offset Voltage (Vos): 25µV; Number of Amplifiers: 1; Operating Supply Current: 1mA; Output Current per Channel: 65mA; Slew Rate: 20V/µs; Supplier: DigiKey; Supplier Part Number: 296-44205-1-ND; Manufacturer Part Number: OPA197IDGKR; RoHS: Compliant; Category: Amplifiers - Op Amps, Buffer, Instrumentation; Stock: 2306; Pricing: 1=2.1, 10=1.548, 25=1.4112, 100=1.2599, 250=1.18784, 500=1.1475 (USD); Case/Package: VSSOP; Gain Bandwidth Product: 10MHz; Height: 0m; Lead Free: Lead Free; Length: 3mm; Lifecycle Status: Production; Max Operating Temperature: 125°C; Min Operating Temperature: -40°C; Mounting Technology: Surface Mount; Number of Channels: 1; Number of Circuits: 1; Pins: 8; Packaging: Cut Tape; REACH SVHC: No; Schedule B: 8542330000; Thickness: 970µm; Width: 3mm; ComponentLink1URL: https://sigma.octopart.com:443/178522223/technical_drawing/Texas-Instruments-OPA197IDGKR.pdf?src-supplier=Texas+Instruments; ComponentLink1Description: https://sigma.octopart.com:443/178522223/technical_drawing/Texas-Instruments-OPA197IDGKR.pdf?src-supplier=Texas+Instruments; ComponentLink2URL: https://octopart.com:443/opatz8j6/c1?t=FOH0RitQzD0XlKnT_NgRAgueVSVogVIH0_VtQKvX5g7tSbiKJHTY1QoPj-fRZWmhrDdG3-oaeD6KdjkigGqv_J-kshTw3jN_-Wt-WPxaVrD8pn1GPjwVJZnq1bl9XjIvoPWB7ZeLkdoepKv730yRgLbkP6aQFYp2DXOoQZirO_tZyNijjj9IWQhNZ18j4ImlA22DVwSTOFbSObjO7PzHae2dQ8oh_w5MV0QKndgc48Q4_peIBbvSJ5ut7KrVy2MbvjxsXzd0WmA-PvDo_y8MleauDzvSfGCoV1tfcR96dhtUS7VWbLwUJ1LuFIJRQw7vaioM7VjuujX3Pxl55TpYA49bpJc_AW7jaO84eqgHL_99ZB-Z4JMV0rb-u9axked6zFdf0Q&src-supplier=Texas+Instruments; ComponentLink2Description: https://octopart.com:443/opatz8j6/c1?t=FOH0RitQzD0XlKnT_NgRAgueVSVogVIH0_VtQKvX5g7tSbiKJHTY1QoPj-fRZWmhrDdG3-oaeD6KdjkigGqv_J-kshTw3jN_-Wt-WPxaVrD8pn1GPjwVJZnq1bl9XjIvoPWB7ZeLkdoepKv730yRgLbkP6aQFYp2DXOoQZirO_tZyNijjj9IWQhNZ18j4ImlA22DVwSTOFbSObjO7PzHae2dQ8oh_w5MV0QKndgc48Q4_peIBbvSJ5ut7KrVy2MbvjxsXzd0WmA-PvDo_y8MleauDzvSfGCoV1tfcR96dhtUS7VWbLwUJ1LuFIJRQw7vaioM7VjuujX3Pxl55TpYA49bpJc_AW7jaO84eqgHL_99ZB-Z4JMV0rb-u9axked6zFdf0Q&src-supplier=Texas+Instruments; ComponentLink3URL: https://datasheet.octopart.com:443/OPA197IDGKR-Texas-Instruments-datasheet-62062805.pdf?src-supplier=Texas+Instruments; ComponentLink3Description: https://datasheet.octopart.com:443/OPA197IDGKR-Texas-Instruments-datasheet-62062805.pdf?src-supplier=Texas+Instruments; ComponentLink4URL: https://sigma.octopart.com:443/49250154/technical_drawing/Texas-Instruments-OPA197IDGKR.pdf?src-supplier=Texas+Instruments; ComponentLink4Description: https://sigma.octopart.com:443/49250154/technical_drawing/Texas-Instruments-OPA197IDGKR.pdf?src-supplier=Texas+Instruments; ComponentLink5URL: https://datasheet.octopart.com:443/OPA197IDGKR-Texas-Instruments-datasheet-65713346.pdf?src-supplier=Newark; ComponentLink5Description: https://datasheet.octopart.com:443/OPA197IDGKR-Texas-Instruments-datasheet-65713346.pdf?src-supplier=Newark; ComponentLink6URL: https://datasheet.octopart.com:443/OPA197IDGKR-Texas-Instruments-datasheet-62333749.pdf?src-supplier=element14+APAC; ComponentLink6Description: https://datasheet.octopart.com:443/OPA197IDGKR-Texas-Instruments-datasheet-62333749.pdf?src-supplier=element14+APAC; ComponentLink7URL: https://datasheet.octopart.com:443/OPA197IDGKR-Texas-Instruments-datasheet-164361763.pdf?src-supplier=SHENGYU+ELECTRONICS; ComponentLink7Description: https://datasheet.octopart.com:443/OPA197IDGKR-Texas-Instruments-datasheet-164361763.pdf?src-supplier=SHENGYU+ELECTRONICS; ComponentLink8URL: https://datasheet.octopart.com:443/OPA197IDGKR-Texas-Instruments-datasheet-100480384.pdf?src-supplier=HQonline; ComponentLink8Description: https://datasheet.octopart.com:443/OPA197IDGKR-Texas-Instruments-datasheet-100480384.pdf?src-supplier=HQonline; ComponentLink9URL: https://datasheet.octopart.com:443/OPA197IDGKR-Texas-Instruments-datasheet-140571582.pdf?src-supplier=Arrow.cn; ComponentLink9Description: https://datasheet.octopart.com:443/OPA197IDGKR-Texas-Instruments-datasheet-140571582.pdf?src-supplier=Arrow.cn; ComponentLink10URL: http://sigma.octopart.com:80/reach_statement/Texas-Instruments-company-64.pdf?src-supplier=Compliance+Statements; ComponentLink10Description: http://sigma.octopart.com:80/reach_statement/Texas-Instruments-company-64.pdf?src-supplier=Compliance+Statements; ComponentLink11URL: http://sigma.octopart.com:80/conflict_mineral_statement/Texas-Instruments-company-63.pdf?src-supplier=Compliance+Statements; ComponentLink11Description: http://sigma.octopart.com:80/conflict_mineral_statement/Texas-Instruments-company-63.pdf?src-supplier=Compliance+Statements

## Sheet 70_MODULE_INTERFACE.SchDoc
size A; SheetNumber: 8; SheetTotal: 8
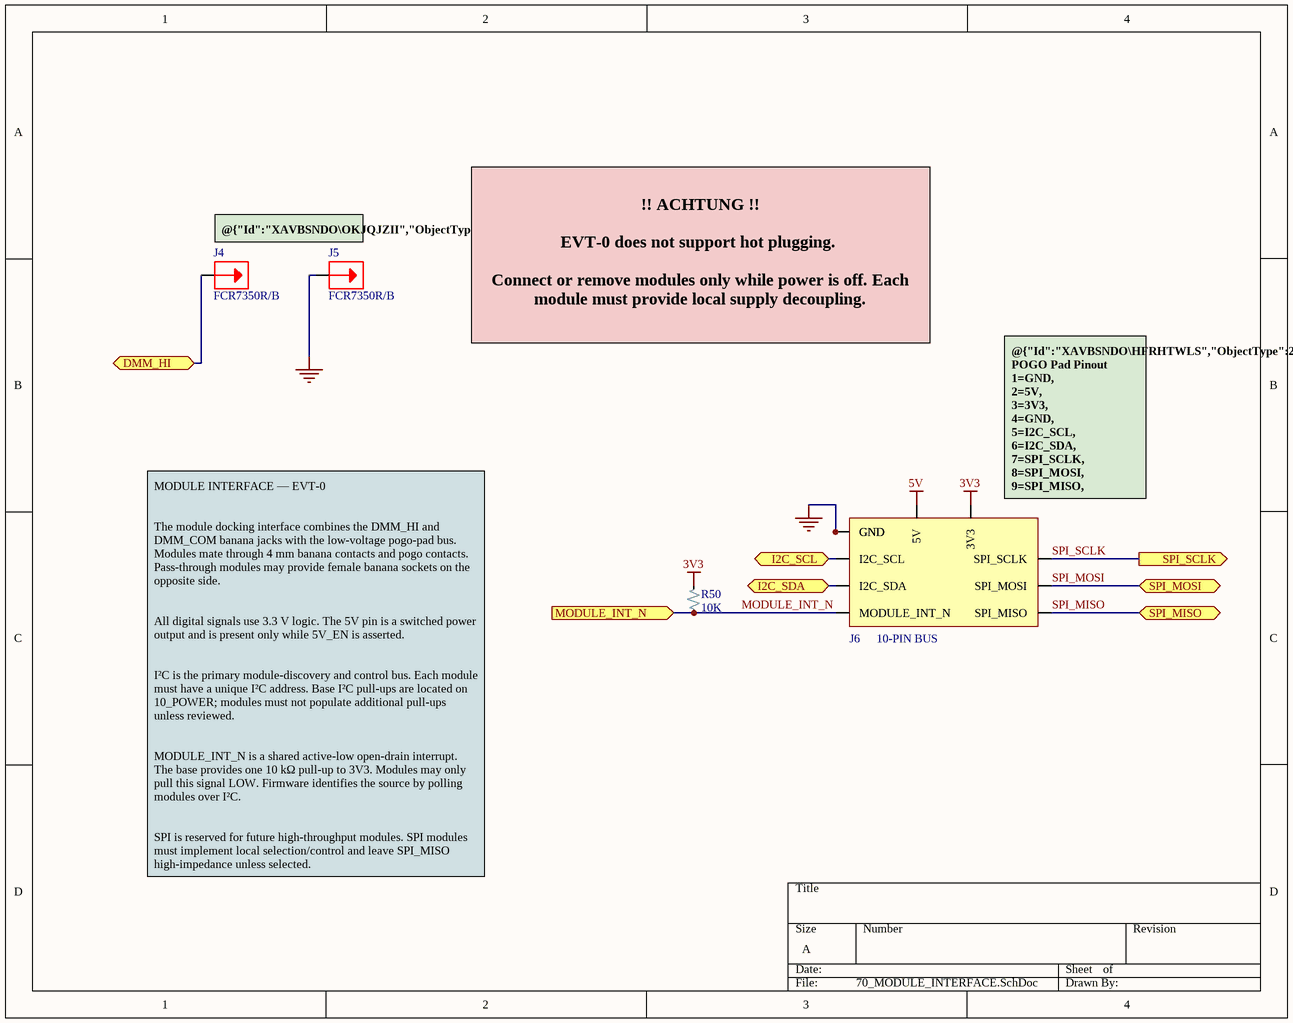
[diagram p4: 70_MODULE_INTERFACE.SchDoc]

### Parts
J4  FCR7350R/B  [FCR7350_S16-PC]
J5  FCR7350R/B  [FCR7350_S16-PC]
J6  10-PIN BUS  [MODULE_BUS_10_TAB_SLOT]
R50  10K  [R0805]

### Ports
DMM_HI (bidir, see 00_SYSTEM_TOP[1C], 40_INPUT_ROUTING[1B]), I2C_SCL (bidir, see 00_SYSTEM_TOP[2B], 10_POWER[3C], 20_MCU_BLE[1B]), I2C_SDA (bidir, see 00_SYSTEM_TOP[2B], 10_POWER[3C], 20_MCU_BLE[1C]), MODULE_INT_N (in, see 00_SYSTEM_TOP[2B], 20_MCU_BLE[1B]), SPI_MISO (bidir, see 00_SYSTEM_TOP[2C], 20_MCU_BLE[1B], 30_ADC[4C]), SPI_MOSI (bidir, see 00_SYSTEM_TOP[2C], 20_MCU_BLE[1B], 30_ADC[4C]), SPI_SCLK (out, see 00_SYSTEM_TOP[2C], 20_MCU_BLE[1B], 30_ADC[4C])

### Nets
3V3: J6.3(3V3) R50.2
5V: J6.2(5V)
GND: J5.1(IN) J6.1(GND) J6.4(GND)
I2C_SCL: J6.5(I2C_SCL) ; port I2C_SCL
I2C_SDA: J6.6(I2C_SDA) ; port I2C_SDA
MODULE_INT_N: J6.10(MODULE_INT_N) R50.1 ; port MODULE_INT_N
SPI_MISO: J6.9(SPI_MISO) ; port SPI_MISO
SPI_MOSI: J6.8(SPI_MOSI) ; port SPI_MOSI
SPI_SCLK: J6.7(SPI_SCLK) ; port SPI_SCLK
NetJ4_1: J4.1(IN) ; port DMM_HI

### Notes on the sheet
- @{"Id":"XAVBSNDO\OKJQJZII","ObjectType":2}   DMM Probes   @{"Id":"XAVBSNDO\EBBIREGQ","ObjectType":2}
- !! ACHTUNG !!
  EVT-0 does not support hot plugging.
  Connect or remove modules only while power is off. Each module must provide local supply decoupling.
- (near J6) @{"Id":"XAVBSNDO\HFRHTWLS","ObjectType":2} POGO Pad Pinout
  1=GND,
  2=5V,
  3=3V3,
  4=GND,
  5=I2C_SCL,
  6=I2C_SDA,
  7=SPI_SCLK,
  8=SPI_MOSI,
  9=SPI_MISO,
  10=MODULE_INT_N
- MODULE INTERFACE — EVT-0
  The module docking interface combines the DMM_HI and DMM_COM banana jacks with the low-voltage pogo-pad bus. Modules mate through 4 mm banana contacts and pogo contacts. Pass-through modules may provide female banana sockets on the opposite side.
  All digital signals use 3.3 V logic. The 5V pin is a switched power output and is present only while 5V_EN is asserted.
  I²C is the primary module-discovery and control bus. Each module must have a unique I²C address. Base I²C pull-ups are located on 10_POWER; modules must not populate additional pull-ups unless reviewed.
  MODULE_INT_N is a shared active-low open-drain interrupt. The base provides one 10 kΩ pull-up to 3V3. Modules may only pull this signal LOW. Firmware identifies the source by polling modules over I²C.
  SPI is reserved for future high-throughput modules. SPI modules must implement local selection/control and leave SPI_MISO high-impedance unless selected.

### Library data of the parts
J4 J5 = FCR7350: 4 mm shrouded banana socket, PCB mount; Manufacturer: Cliff; Current Rating: 24A; Gender: Receptacle; Voltage Rating: 1kV; Supplier: DigiKey; Supplier Part Number: 4654-FCR7350R-ND; Manufacturer Part Number: FCR7350R; RoHS: Compliant; Category: Connectors; Stock: 10020; Pricing: 1=7.66, 10=6.509, 25=6.1016, 50=5.8102, 100=5.5327, 300=5.12017, 500=4.93902, 1000=4.70352 (USD); Color: Red; Connector Type: Socket; Contact Material: Gold; Contact Plating: Gold; Height: 10.922mm; Insulation Material: PVC; Lifecycle Status: Production; Mounting Technology: Through Hole; REACH SVHC: Yes; Termination: Through Hole; Voltage Rating (DC): 1kV; Weight: 4.535924g; Width: 11.938mm; ComponentLink1URL: https://datasheet.octopart.com:443/FCR7350R-Cliff-datasheet-67476090.pdf?src-supplier=IHS; ComponentLink1Description: https://datasheet.octopart.com:443/FCR7350R-Cliff-datasheet-67476090.pdf?src-supplier=IHS; ComponentLink2URL: https://datasheet.octopart.com:443/FCR7350R-Cliff-datasheet-10025950.pdf?src-supplier=element14+APAC; ComponentLink2Description: https://datasheet.octopart.com:443/FCR7350R-Cliff-datasheet-10025950.pdf?src-supplier=element14+APAC; ComponentLink3URL: https://datasheet.octopart.com:443/FCR7350R-Cliff-datasheet-188862624.pdf?src-supplier=TME; ComponentLink3Description: https://datasheet.octopart.com:443/FCR7350R-Cliff-datasheet-188862624.pdf?src-supplier=TME; ComponentLink4URL: https://datasheet.octopart.com:443/FCR7350R-Cliff-datasheet-10027538.pdf?src-supplier=Farnell; ComponentLink4Description: https://datasheet.octopart.com:443/FCR7350R-Cliff-datasheet-10027538.pdf?src-supplier=Farnell
J6 = J_MODULE_BUS: 10-pin stackable module interface for power, I2C, SPI, and shared interrupt
R50 = R_0805: as R35 on sheet 40_INPUT_ROUTING; Supplier: DigiKey; Supplier Part Number: RNCF0805TKY10K0CT-ND; RoHS: Compliant; Category: Chip SMD Resistors; Stock: 4649; Pricing: 1=1.61, 10=1.334, 50=1.1716, 100=1.1105, 500=0.99044, 1000=0.94751, 2000=0.90945, 3000=0.8893, 5000=0.86599, 7000=0.85183, 10000=0.8378 (USD); Case/Package: 0805; Case Code (Imperial): 0805; Case Code (Metric): 2012; Composition: Thin Film; Country of Origin: Taiwan; Export Control Classification Number (ECCN) Code: EAR99; Features: Moisture Resistant; Height: 550µm; Harmonized Tariff Schedule (HTS) Code: 8533.21.00.30; Introduction Date: 2011-06-03; Lead Free: Lead Free; Length: 2mm; Lifecycle Status: Production; Max Operating Temperature: 155°C; Min Operating Temperature: -55°C; Mounting Technology: Surface Mount; Number of Terminals: 2; Number of Terminations: 2; Packaging: Tape & Reel (TR); Power Rating: 125mW; Ratings: AEC-Q200; REACH SVHC: Yes; Schedule B: 8533210045, 8533210045|8533210045|8533210045|8533210045|8533210045; Width: 1.25mm; ComponentLink1URL: https://datasheet.octopart.com:443/RNCF0805TKY10K0-Stackpole-Electronics-datasheet-182148124.pdf?src-supplier=IHS; ComponentLink1Description: https://datasheet.octopart.com:443/RNCF0805TKY10K0-Stackpole-Electronics-datasheet-182148124.pdf?src-supplier=IHS; ComponentLink2URL: https://datasheet.octopart.com:443/RNCF0805TKY10K0-Stackpole-Electronics-datasheet-12511394.pdf?src-supplier=Factory+Futures; ComponentLink2Description: https://datasheet.octopart.com:443/RNCF0805TKY10K0-Stackpole-Electronics-datasheet-12511394.pdf?src-supplier=Factory+Futures; ComponentLink3URL: https://datasheet.octopart.com:443/RNCF0805TKY10K0-Stackpole-Electronics-datasheet-141158876.pdf?src-supplier=Stackpole+Electronics; ComponentLink3Description: https://datasheet.octopart.com:443/RNCF0805TKY10K0-Stackpole-Electronics-datasheet-141158876.pdf?src-supplier=Stackpole+Electronics; ComponentLink4URL: https://datasheet.octopart.com:443/RNCF0805TKY10K0-Stackpole-Electronics-datasheet-28504821.pdf?src-supplier=Master+Electronics; ComponentLink4Description: https://datasheet.octopart.com:443/RNCF0805TKY10K0-Stackpole-Electronics-datasheet-28504821.pdf?src-supplier=Master+Electronics; ComponentLink5URL: https://datasheet.octopart.com/RNCF0805TKY10K0-Stackpole-Electronics-datasheet-11755897.pdf; ComponentLink5Description: https://datasheet.octopart.com/RNCF0805TKY10K0-Stackpole-Electronics-datasheet-11755897.pdf; ComponentLink6URL: http://sigma.octopart.com:80/15941409/materials_sheet/Stackpole-Electronics-RNCF0805TKY10K0.pdf?src-supplier=Compliance+Statements; ComponentLink6Description: http://sigma.octopart.com:80/15941409/materials_sheet/Stackpole-Electronics-RNCF0805TKY10K0.pdf?src-supplier=Compliance+Statements; ComponentLink7URL: http://sigma.octopart.com:80/141158212/rohs_statement/Stackpole-Electronics-RNCF0805TKY10K0.pdf?src-supplier=Compliance+Statements; ComponentLink7Description: http://sigma.octopart.com:80/141158212/rohs_statement/Stackpole-Electronics-RNCF0805TKY10K0.pdf?src-supplier=Compliance+Statements; ComponentLink8URL: http://sigma.octopart.com:80/141158211/reach_statement/Stackpole-Electronics-RNCF0805TKY10K0.pdf?src-supplier=Compliance+Statements; ComponentLink8Description: http://sigma.octopart.com:80/141158211/reach_statement/Stackpole-Electronics-RNCF0805TKY10K0.pdf?src-supplier=Compliance+Statements

## Nets that join several sheets
3V3: 10_POWER (7 pins), 30_ADC (C19.2 C20.2 U6.13), 40_INPUT_ROUTING (D2.1 K1.1), 70_MODULE_INTERFACE (J6.3 R50.2)
5V: 10_POWER (5 pins), 70_MODULE_INTERFACE (J6.2)
+2V5A: 10_POWER (C3.2 R2.2 U1.11), 30_ADC (6 pins), 40_INPUT_ROUTING (K1.7), 50_VOLTAGE_FRONTEND (C29.1 U8.7)
-2V5A: 10_POWER (C5.2 R10.1 U1.6), 30_ADC (C25.2 C27.1 U6.5), 50_VOLTAGE_FRONTEND (C30.1 U8.4)
GND: 10_POWER (43 pins), 30_ADC (13 pins), 40_INPUT_ROUTING (Q1.2 R35.1), 50_VOLTAGE_FRONTEND (C29.2 C30.2 R49.1), 70_MODULE_INTERFACE (J5.1 J6.1 J6.4)
I2C_SCL: 10_POWER (R21.2 U4.B1), 70_MODULE_INTERFACE (J6.5)
I2C_SDA: 10_POWER (R22.2 U4.C1), 70_MODULE_INTERFACE (J6.6)
NetJ4_1: 40_INPUT_ROUTING (K1.3), 70_MODULE_INTERFACE (J4.1)
NetK1_2: 40_INPUT_ROUTING (K1.2), 50_VOLTAGE_FRONTEND (R45.1)
SPI_MISO: 30_ADC (R33.2), 70_MODULE_INTERFACE (J6.9)
SPI_MOSI: 30_ADC (R32.2), 70_MODULE_INTERFACE (J6.8)
SPI_SCLK: 30_ADC (R31.2), 70_MODULE_INTERFACE (J6.7)
VSENSE_BUF: 30_ADC (R28.1), 50_VOLTAGE_FRONTEND (U8.2 U8.6)